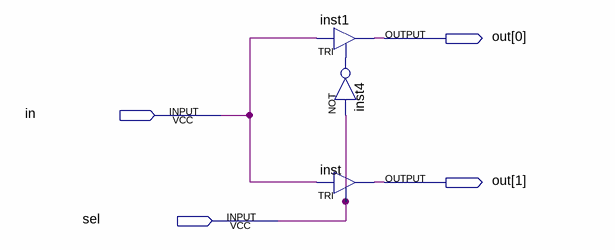
[diagram p0: schematic sheet]
// Quartus schematic mux1to2.bdf as structural Verilog: 3 symbols, 4 pins
module mux1to2 (
  input  in,
  input  sel,
  output [1:0] out
);

  wire inst4_out;

  TRI inst1 (.IN(in), .OE(inst4_out), .OUT(out[0]));
  not inst4 (inst4_out, sel);
  TRI inst (.IN(in), .OE(sel), .OUT(out[1]));
endmodule
